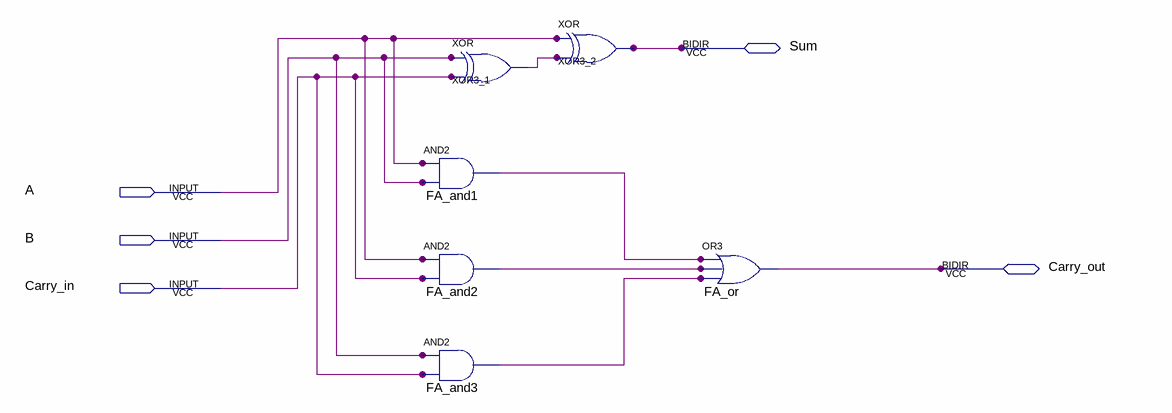
[diagram p0: schematic sheet]
// Quartus schematic Yongru_Pan_VHDL3_FA.bdf as structural Verilog: 6 symbols, 5 pins
module Yongru_Pan_VHDL3_FA (
  input  A,
  input  B,
  input  Carry_in,
  inout  Sum,
  inout  Carry_out
);

  wire FA_and1_out, FA_and2_out, FA_and3_out, XOR3_1_out;

  and FA_and1 (FA_and1_out, A, B);
  and FA_and2 (FA_and2_out, A, Carry_in);
  and FA_and3 (FA_and3_out, B, Carry_in);
  xor XOR3_1 (XOR3_1_out, B, Carry_in);
  xor XOR3_2 (Sum, A, XOR3_1_out);
  or FA_or (Carry_out, FA_and1_out, FA_and2_out, FA_and3_out);
endmodule
